# EAGLE design lief-p0r2 (EAGLE 7.5.0)
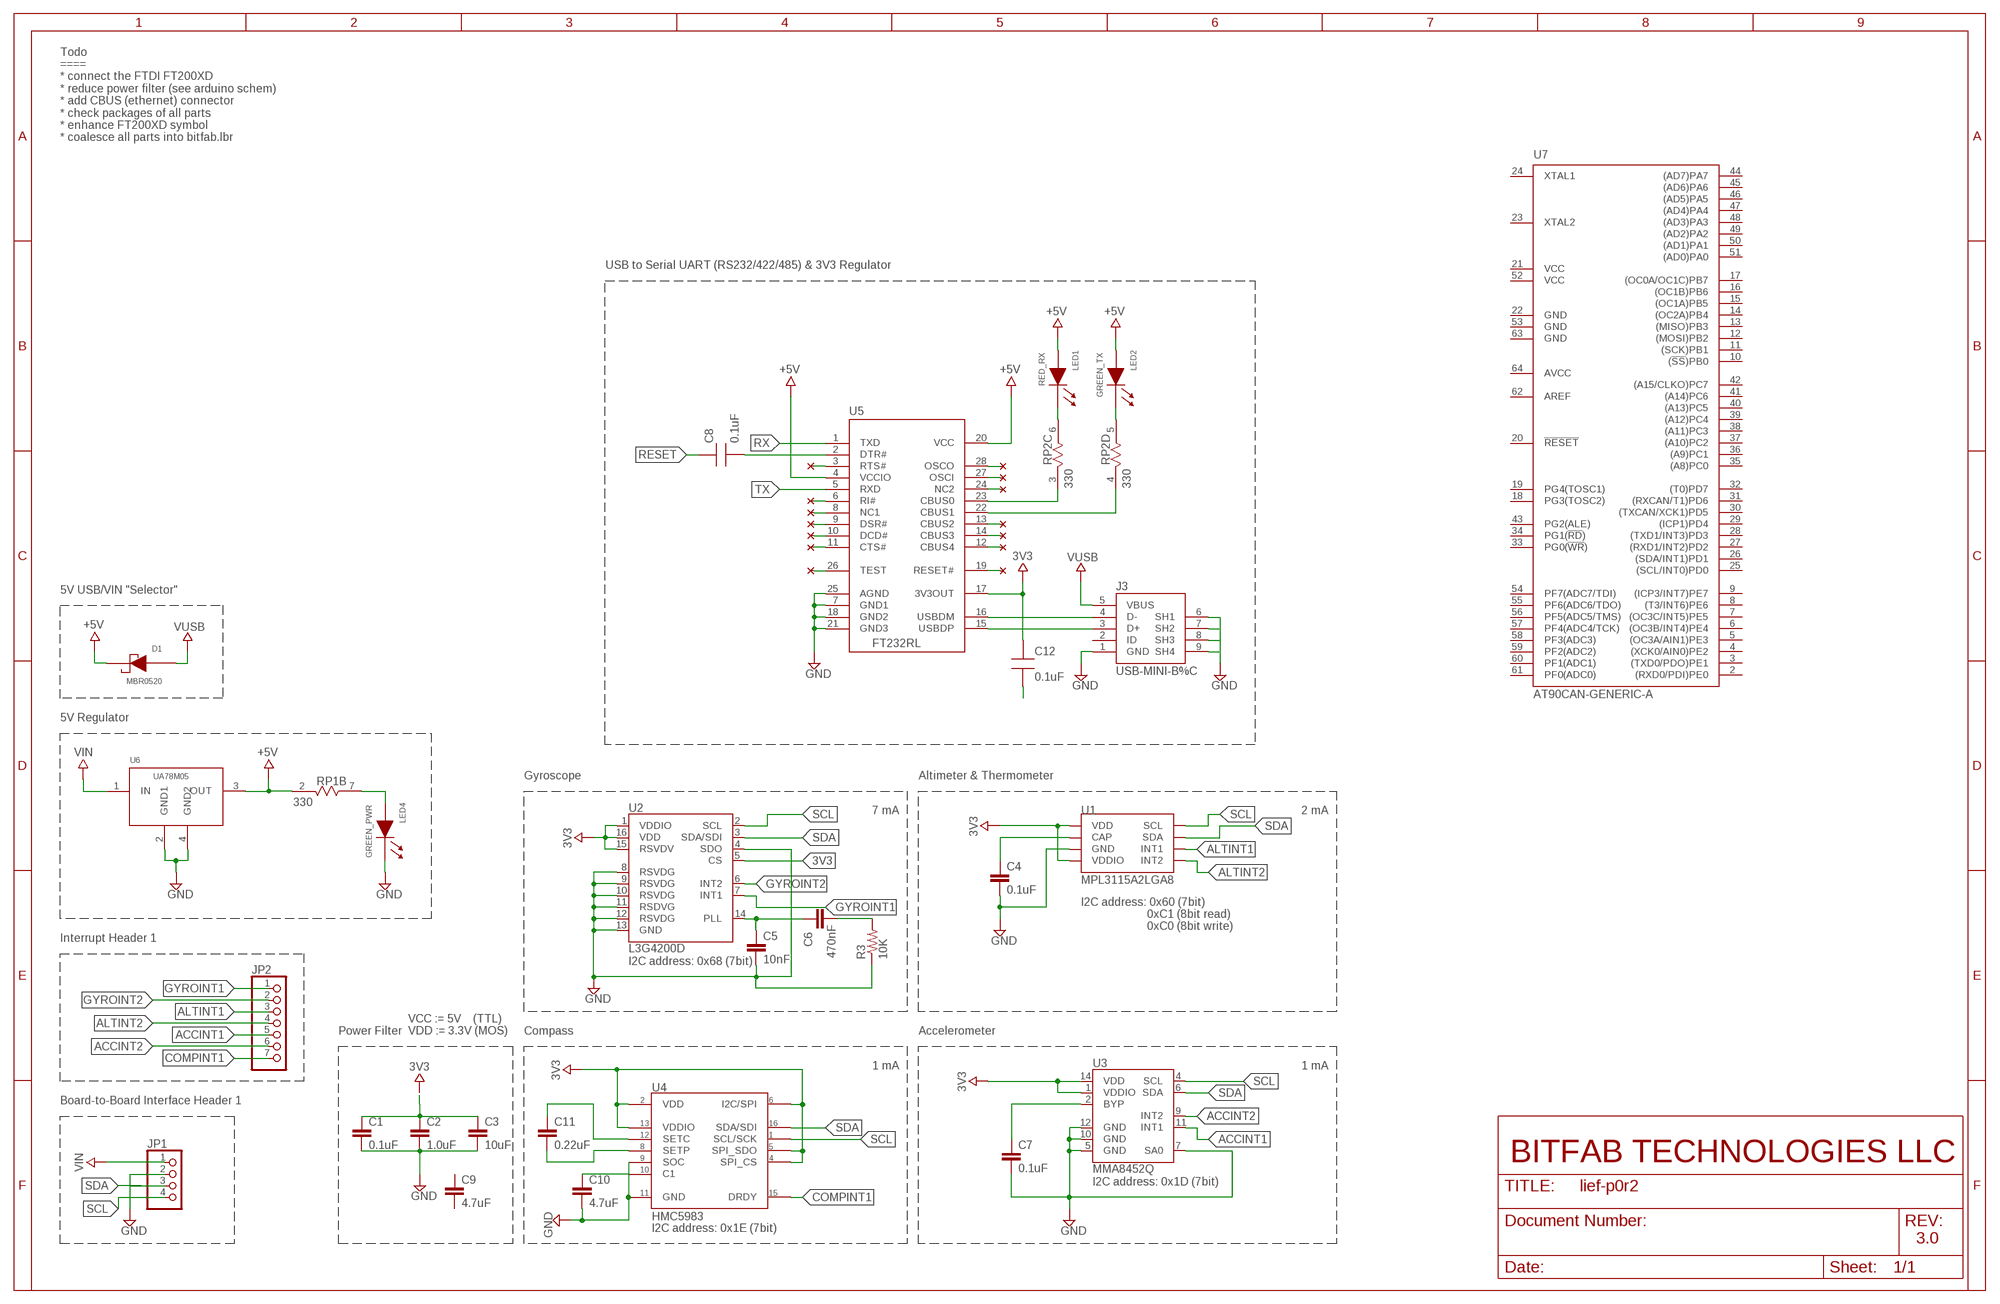
[diagram p0: schematic, sheet 1]

## Parts
C1  0.1uF  0.1UF-25V(+80/-20%)(0603)  [0603-CAP]
C2  1.0uF  1.0UF-25V-+80/-20(0805)"  [0805-CAP]
C3  10uF  1.0UF-25V-+80/-20(0805)"  [0805-CAP]
C4  0.1uF  1.0UF-25V-+80/-20(0805)"  [0805-CAP]
C5  10nF  1.0UF-25V-+80/-20(0805)"  [0805-CAP]
C6  470nF  1.0UF-25V-+80/-20(0805)"  [0805-CAP]
C7  0.1uF  0.1UF-100V-10%(0603)  [0603-CAP]
C8  0.1uF  CAP0805-NP  [CAP0805-NP]
C9  4.7uF  0.1UF-100V-10%(0603)  [0603-CAP]
C10  4.7uF  1.0UF-25V-+80/-20(0805)"  [0805-CAP]
C11  0.22uF  1.0UF-25V-+80/-20(0805)"  [0805-CAP]
C12  0.1uF  CAP0805-NP  [CAP0805-NP]
D1  MBR0520  [SOD-123]
J3  USB-MINI-B%C  [USB-MINI-B_2]
JP1  PINHD-1X4  [1X04]
JP2  PINHD-1X7  [1X07]
LED1  RED_RX  LED0805  [LED0805]
LED2  GREEN_TX  LED0805  [LED0805]
LED4  GREEN_PWR  LED0805  [LED0805]
R3  10K  R-US_0204/2V  [0204V]
RP1  330  RES4NT  [RES4NT]
RP2  330  RES4NT  [RES4NT]
U1  MPL3115A2LGA8  [LGA8]
U2  L3G4200D  [LGA16-4X4]
U3  MMA8452Q  [QFN-16_0.5MM]
U4  HMC5983  [HMC5983-LPCC16]
U5  FT232RL  [SSOP28]
U6  UA78M05  [SOT223]
U7  AT90CAN-GENERIC-A  [TQFP64]

## Nets
3V3: C1.1 C2.1 C3.1 C12.1 U1.1(VDD) U1.4(VDDIO) U2.1(VDDIO) U2.5(CS) U2.15(RSVDV) U2.16(VDD) U3.1(VDDIO) U3.14(VDD) U4.I2C/SPI U4.SPI_CS/S1(SPI_CS) U4.SPI_SDO U4.VDD U4.VDDIO U5.17(3V3OUT)
+5V: D1.1(CA) LED1.2(AN) LED2.2(AN) RP1.2 U5.4(VCCIO) U5.20(VCC) U6.3(OUT)
ACCINT1: JP2.5 U3.11(INT1)
ACCINT2: JP2.6 U3.9(INT2)
ALTINT1: JP2.3 U1.6(INT1)
ALTINT2: JP2.4 U1.5(INT2)
COM: C12.2
COMPINT1: JP2.7 U4.DRDY
GND: C1.2 C2.2 C3.2 C4.2 C5.2 C7.2 C10.2 J3.1(GND) J3.6(SH1) J3.7(SH2) J3.8(SH3) J3.9(SH4) JP1.2 JP1.3 LED4.1(CA) R3.1 U1.3(GND) U2.4(SDO) U2.8(RSVDG) U2.9(RSVDG) U2.10(RSVDG) U2.11(RSDVG) U2.12(RSVDG) U2.13(GND) U3.5(GND) U3.7(SA0) U3.10(GND) U3.12(GND) U4.GND U4.SOC U5.7(GND1) U5.18(GND2) U5.21(GND3) U5.25(AGND) U6.2(GND1) U6.4(GND2)
GYROINT1: JP2.1 U2.7(INT1)
GYROINT2: JP2.2 U2.6(INT2)
N$1: LED4.2(AN) RP1.7
N$2: J3.3(D+) U5.15(USBDP)
N$3: J3.4(D-) U5.16(USBDM)
N$4: C8.2 U5.2(DTR#)
N$5: C11.1 U4.SETC
N$6: C4.1 U1.2(CAP)
N$7: C6.2 R3.2
N$8: C5.1 C6.1 U2.14(PLL)
N$9: C7.1 U3.2(BYP)
N$10: C11.2 U4.SETP
N$11: RP2.3 U5.23(CBUS0)
N$12: C10.1 U4.C1
N$13: RP2.4 U5.22(CBUS1)
N$14: U5.11(CTS#)
N$15: U5.6(RI#)
N$16: U5.8(NC1)
N$17: U5.9(DSR#)
N$18: U5.10(DCD#)
N$19: U5.28(OSCO)
N$20: U5.27(OSCI)
N$21: U5.24(NC2)
N$22: U5.13(CBUS2)
N$23: U5.14(CBUS3)
N$24: U5.12(CBUS4)
N$25: U5.19(RESET#)
N$26: U5.26(TEST)
N$27: U5.3(RTS#)
N$28: LED1.1(CA) RP2.6
N$29: LED2.1(CA) RP2.5
RESET: C8.1
RX: U5.1(TXD)
SCL: JP1.4 U1.8(SCL) U2.2(SCL) U3.4(SCL) U4.SCL/SPI_SCK(SCL/SCK)
SDA: U1.7(SDA) U2.3(SDA/SDI) U3.6(SDA) U4.SDA/SPI_SDI(SDA/SDI)
TX: U5.5(RXD)
VIN: JP1.1 U6.1(IN)
VUSB: D1.2(AN) J3.5(VBUS)
Unconnected: C9.1 C9.2 J3.2(ID) RP1.1 RP1.3 RP1.4 RP1.5 RP1.6 RP1.8 RP2.1 RP2.2 RP2.7 RP2.8 U7.2((RXD0/PDI)PE0) U7.3((TXD0/PDO)PE1) U7.4((XCK0/AIN0)PE2) U7.5((OC3A/AIN1)PE3) U7.6((OC3B/INT4)PE4) U7.7((OC3C/INT5)PE5) U7.8((T3/INT6)PE6) U7.9((ICP3/INT7)PE7) U7.10((!SS!)PB0) U7.11((SCK)PB1) U7.12((MOSI)PB2) U7.13((MISO)PB3) U7.14((OC2A)PB4) U7.15((OC1A)PB5) U7.16((OC1B)PB6) U7.17((OC0A/OC1C)PB7) U7.18(PG3(TOSC2)) U7.19(PG4(TOSC1)) U7.20(!RESET) U7.23(XTAL2) U7.24(XTAL1) U7.25((SCL/INT0)PD0) U7.26((SDA/INT1)PD1) U7.27((RXD1/INT2)PD2) U7.28((TXD1/INT3)PD3) U7.29((ICP1)PD4) U7.30((TXCAN/XCK1)PD5) U7.31((RXCAN/T1)PD6) U7.32((T0)PD7) U7.33(PG0(!WR!)) U7.34(PG1(!RD!)) U7.35((A8)PC0) U7.36((A9)PC1) U7.37((A10)PC2) U7.38((A11)PC3) U7.39((A12)PC4) U7.40((A13)PC5) U7.41((A14)PC6) U7.42((A15/CLKO)PC7) U7.43(PG2(ALE)) U7.44((AD7)PA7) U7.45((AD6)PA6) U7.46((AD5)PA5) U7.47((AD4)PA4) U7.48((AD3)PA3) U7.49((AD2)PA2) U7.50((AD1)PA1) U7.51((AD0)PA0) U7.54(PF7(ADC7/TDI)) U7.55(PF6(ADC6/TDO)) U7.56(PF5(ADC5/TMS)) U7.57(PF4(ADC4/TCK)) U7.58(PF3(ADC3)) U7.59(PF2(ADC2)) U7.60(PF1(ADC1)) U7.61(PF0(ADC0)) U7.62(AREF)

## Notes on the sheet
- Todo
  ====
  * connect the FTDI FT200XD
  * reduce power filter (see arduino schem)
  * add CBUS (ethernet) connector
  * check packages of all parts
  * enhance FT200XD symbol
  * coalesce all parts into bitfab.lbr
- USB to Serial UART (RS232/422/485) & 3V3 Regulator
- 5V USB/VIN "Selector"
- 5V Regulator
- Gyroscope | Altimeter & Thermometer
- 7 mA | 2 mA
- I2C address: 0x60 (7bit)
                        0xC1 (8bit read)
                        0xC0 (8bit write)
- Interrupt Header 1
- I2C address: 0x68 (7bit)
- Power Filter
- VCC := 5V    (TTL)
  VDD := 3.3V (MOS)
- Compass | Accelerometer
- 1 mA | 1 mA
- Board-to-Board Interface Header 1
- BITFAB TECHNOLOGIES LLC
- I2C address: 0x1D (7bit)
- I2C address: 0x1E (7bit)
- 3.0

## Power pins joined to a net without a drawn wire
AVCC: U7.64(AVCC)
GND: U7.22(GND) U7.53(GND) U7.63(GND)
VCC: U7.21(VCC) U7.52(VCC)

## Library data of the parts
C1 = SparkFun-Capacitors:0.1UF-25V(+80/-20%)(0603): CAP-00810 Ceramic Standard decoupling cap; PROD_ID: CAP-00810
C2 = SparkFun-Capacitors:1.0UF-25V-+80/-20(0805): CAP-11625; PROD_ID: CAP-11625
C3-C6 C10 C11 = SparkFun-Capacitors:1.0UF-25V-+80/-20(0805): CAP-11625; PROD_ID: CAP-11625; VALUE: 1.0uF
C7 = SparkFun-Capacitors:0.1UF-100V-10%(0603): CAP-08390; PROD_ID: CAP-08390
C8 C12 = MySMD:CAP0805-NP
C9 = SparkFun-Capacitors:0.1UF-100V-10%(0603): CAP-08390; PROD_ID: CAP-08390; VALUE: 0.1uF
D1 = MySMD:MBR0520
J3 = MyCON2:USB-MINI-B
JP1 = pinhead:PINHD-1X4: PIN HEADER
JP2 = pinhead:PINHD-1X7: PIN HEADER
LED1 LED2 LED4 = MySMD:LED0805
R3 = resistor:R-US_: RESISTOR, American symbol
RP1 RP2 = MySMD:RES4NT
U1 = SparkFun-Sensors:MPL3115A2: Altimeter/Pressure Sensor, I2C, 1.95V-3.6V supply, 50 to 110kPa; PROD_ID: IC-10869
U2 = SparkFun-Sensors:L3G4200D: L3G4200D Three-axis, digital output gyroscope The L3G4200D is a low-power three-axis angular rate sensor, has a full scale of ±250/±500/±2000 dps and is capable of measuring rates with a user-selectable bandwidth. It includes a sensing element and an IC interface capable of providing the measured angular rate to the external world through a digital interface (I2C/SPI). Package: 4x4x1.1 LGA-16 (LGA16-4x4.PAC)
U3 = SparkFun-Sensors:MMA8452Q: MMA8452Q 3-Axis, 12/8-bit Digital Accelerometer Supply Voltage: 1.6-3.6V Range: +/- 2g, 4g, 8g Interface: I2C, 12-bit and 8-bit ODR: 1.56 Hz - 800 Hz Package: QFN-16 http://cache.freescale.com/files/sensors/doc/data_sheet/MMA8452Q.pdf; PROD_ID: IC-10769
U4 = bitfab:HMC5983: HMC5983 - 3-Axis Digital Compass IC VDD MIN: 2.16V, TYP: 2.5V, MAX: 3.6V, ABSMAX: 4.8V 3.0x3.0x0.9mm LCC Surface Mount Package
U5 = MySMD2:FT232RL
U6 = MySMD:UA78M05
U7 = at90can32_64_128:AT90CAN*: ATMEL AVR AT90CAN32-..A. / 64-..A. / 128-..A., TQFP64 (Atmel Package Code 'A2 64': 64-Lead, Thin 1.0 mm / 0.03937 in. Plastic Gull Wing Quad Flat Package) Ordering Code = Product Marking / Speed (MHz) / Power Supply (V) / Operation Range AT90CANx-16AI / 16 / 2.7 .. 5.5 / Industrial (-40 .. +85)°C AT90CANx-16AU / 16 / 2.7 .. 5.5 / Industrial Green (-40 .. +85)°C x = 32 / 64 / 128 (KB of ISP Flash Memory) Author: Dipl.-Ing. FH Rainer Bayer HHN Hochschule Heilbronn, rainer.bayer@hs-heilbronn.de Ingenieurbüro ing-rb, mail@ing-rb.de

## Board
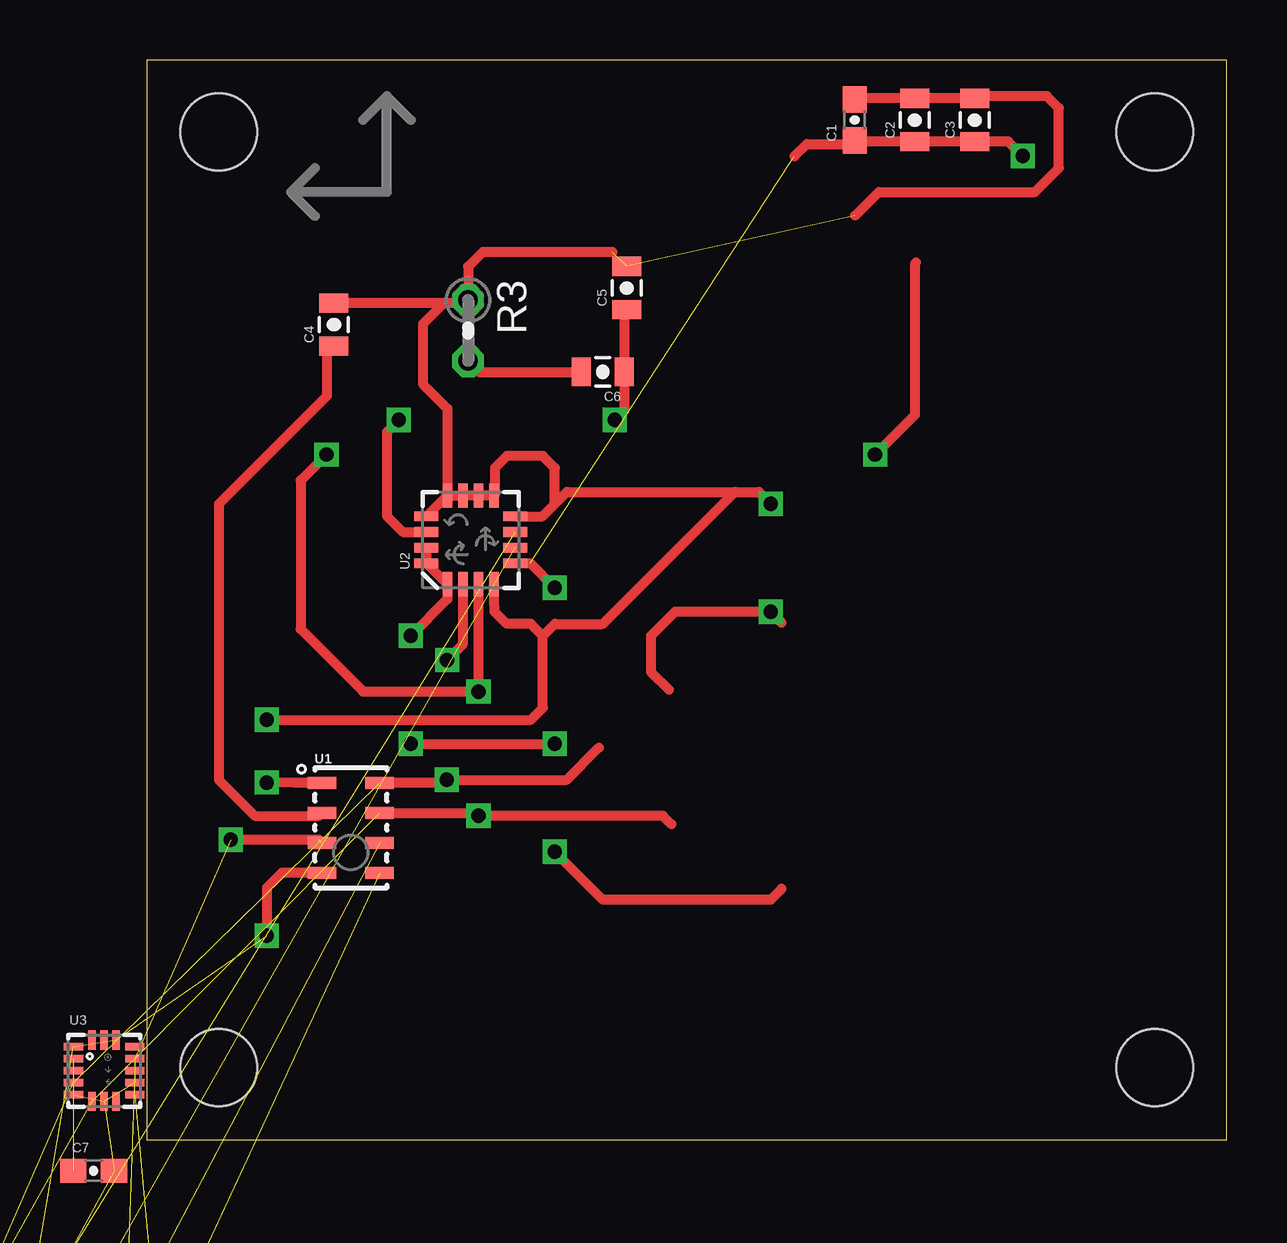
[diagram p1: board, top side]
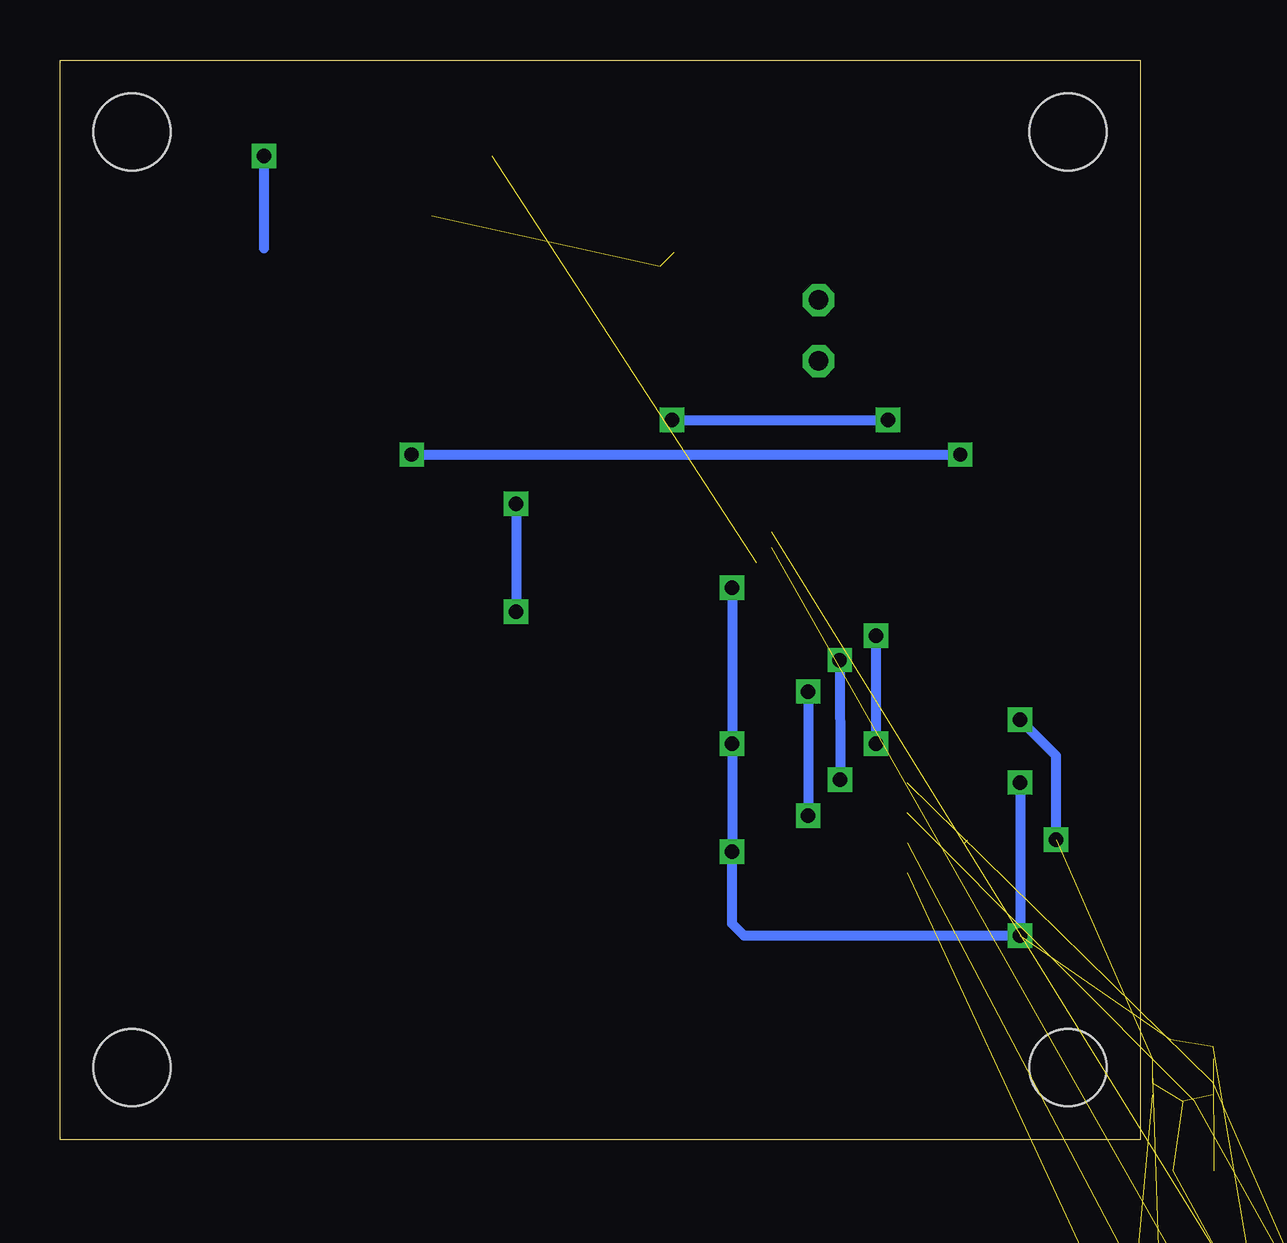
[diagram p2: board, bottom side, seen from below]

Size 45 x 45 mm. Coordinates in mm from the lower left corner, seen from the top.
Outline: 0,0 45,0 45,45 0,45 0,0
Copper layers (1*16): Top 0.035mm / dielectric 1.5mm / Bottom 0.035mm
Design rules "default *": minimum track width 10mil, minimum drill 7mil, track to track 8mil, track to pad 8mil, pad to pad 8mil, via to via 8mil, smd to smd 8mil, copper to edge 40mil, drill to drill 8mil, minimum pad ring 10mil, minimum via ring 8mil, stop-mask expansion 4mil, vias tented up to drill 0mil, thermal gap 10mil
Holes 3.2 mm at 3,3 42,3 42,42 3,42

### Footprints (pad centres in the part's own frame; a part is rotated, then mirrored left to right if it is on the bottom)
0603-CAP = smd 1.1 x 1: 1 -0.85,0; 2 0.85,0
0805-CAP = smd 0.8 x 1.2: 1 -0.9,0; 2 0.9,0
CAP0805-NP = smd 1.524 x 1.524: 1 0,0; 2 2.286,0
SOD-123 = smd 1.143 x 1.143: 1 0,0; 2 3.429,0
USB-MINI-B_2 = smd 0.508 x 2.54: 1 0,0; 2 0.8,0; 3 1.6,0; 4 2.4,0; 5 3.2,0 | smd 2.286 x 1.778: 6 -2.717,5.948; 7 -2.717,0.36; 8 5.918,0.36; 9 5.918,5.948 | hole 0.813: -0.6,2.9; 3.8,2.9
1X04 = drill 1.016 long: 1 -3.81,0; 2 -1.27,0; 3 1.27,0; 4 3.81,0
1X07 = drill 1.016 long: 1 -7.62,0; 2 -5.08,0; 3 -2.54,0; 4 0,0; 5 2.54,0; 6 5.08,0; 7 7.62,0
LED0805 = smd 1.524 x 1.524: 1 0,0; 2 2.286,0
0204V = drill 0.813 octagon: 1 -1.27,0; 2 1.27,0
RES4NT = smd 0.508 x 1.016: 1 0,0; 2 0.8,0; 3 1.6,0; 4 2.4,0; 5 2.4,1.651; 6 1.6,1.651; 7 0.8,1.651; 8 0,1.651
LGA8 = smd 1.2 x 0.5: 1 -1.2,1.875; 2 -1.2,0.625; 3 -1.2,-0.625; 4 -1.2,-1.875; 5 1.2,-1.875; 6 1.2,-0.625; 7 1.2,0.625; 8 1.2,1.875
LGA16-4X4 = smd 1 x 0.4: 1 -1.85,0.975; 2 -1.85,0.325; 3 -1.85,-0.325; 4 -1.85,-0.975; 9 1.85,-0.975; 10 1.85,-0.325; 11 1.85,0.325; 12 1.85,0.975 | smd 0.4 x 1: 5 -0.975,-1.85; 6 -0.325,-1.85; 7 0.325,-1.85; 8 0.975,-1.85; 13 0.975,1.85; 14 0.325,1.85; 15 -0.325,1.85; 16 -0.975,1.85
QFN-16_0.5MM = smd 0.8 x 0.3: 1 -1.275,1; 2 -1.275,0.5; 3 -1.275,0; 4 -1.275,-0.5; 5 -1.275,-1; 9 1.275,-1; 10 1.275,-0.5; 11 1.275,0; 12 1.275,0.5; 13 1.275,1 | smd 0.3 x 0.8: 6 -0.5,-1.275; 7 0,-1.275; 8 0.5,-1.275; 14 0.5,1.275; 15 0,1.275; 16 -0.5,1.275
HMC5983-LPCC16 = smd 0.45 x 0.3: C1 1.275,-0.25; GND 1.275,0.25; NC1 -1.275,-0.25; SCL/SPI_SCK -1.275,0.75; SETC 1.275,0.75; SOC 1.275,-0.75; SPI_CS/S1 -1.275,-0.75; VDD -1.275,0.25 | smd 0.3 x 0.45: DRDY -0.25,1.275; I2C/SPI -0.25,-1.275; NC2 0.25,-1.275; NC3 0.25,1.275; SDA/SPI_SDI -0.75,1.275; SETP 0.75,-1.275; SPI_SDO -0.75,-1.275; VDDIO 0.75,1.275
SSOP28 = smd 0.381 x 2.032: 1 0,0; 2 0.65,0; 3 1.3,0; 4 1.95,0; 5 2.6,0; 6 3.25,0; 7 3.9,0; 8 4.55,0; 9 5.2,0; 10 5.85,0; 11 6.5,0; 12 7.15,0; 13 7.8,0; 14 8.45,0; 15 8.45,7.112; 16 7.8,7.112; 17 7.15,7.112; 18 6.5,7.112; 19 5.85,7.112; 20 5.2,7.112; 21 4.55,7.112; 22 3.9,7.112; 23 3.25,7.112; 24 2.6,7.112; 25 1.95,7.112; 26 1.3,7.112; 27 0.65,7.112; 28 0,7.112
SOT223 = smd 1.524 x 2.032: 1 0,0; 2 2.286,0; 3 4.572,0 | smd 3.81 x 2.032: 4 2.286,6.604
TQFP64 = smd 1.194 x 0.559: 1 -7.76,5.905; 2 -7.76,5.118; 3 -7.76,4.331; 4 -7.76,3.543; 5 -7.76,2.756; 6 -7.76,1.968; 7 -7.76,1.181; 8 -7.76,0.394; 9 -7.76,-0.394; 10 -7.76,-1.181; 11 -7.76,-1.968; 12 -7.76,-2.756; 13 -7.76,-3.543; 14 -7.76,-4.331; 15 -7.76,-5.118; 16 -7.76,-5.905; 33 7.76,-5.905; 34 7.76,-5.118; 35 7.76,-4.331; 36 7.76,-3.543; 37 7.76,-2.756; 38 7.76,-1.968; 39 7.76,-1.181; 40 7.76,-0.394; 41 7.76,0.394; 42 7.76,1.181; 43 7.76,1.968; 44 7.76,2.756; 45 7.76,3.543; 46 7.76,4.331; 47 7.76,5.118; 48 7.76,5.905 | smd 0.559 x 1.194: 17 -5.905,-7.76; 18 -5.118,-7.76; 19 -4.331,-7.76; 20 -3.543,-7.76; 21 -2.756,-7.76; 22 -1.968,-7.76; 23 -1.181,-7.76; 24 -0.394,-7.76; 25 0.394,-7.76; 26 1.181,-7.76; 27 1.968,-7.76; 28 2.756,-7.76; 29 3.543,-7.76; 30 4.331,-7.76; 31 5.118,-7.76; 32 5.905,-7.76; 49 5.905,7.76; 50 5.118,7.76; 51 4.331,7.76; 52 3.543,7.76; 53 2.756,7.76; 54 1.968,7.76; 55 1.181,7.76; 56 0.394,7.76; 57 -0.394,7.76; 58 -1.181,7.76; 59 -1.968,7.76; 60 -2.756,7.76; 61 -3.543,7.76; 62 -4.331,7.76; 63 -5.118,7.76; 64 -5.905,7.76

### Placement (x,y rotation side)
C1  29.5,42.5 90 top
C2  32,42.5 90 top
C3  34.5,42.5 90 top
C4  7.79,33.97 90 top
C5  20,35.5 90 top
C6  19,32 180 top
C7  -2.21,-1.3 0 top
C8  -8.37,-52.64 0 top  (outside the outline)
C9  -2.21,-7.21 0 top  (outside the outline)
C10  -8.78,-6.96 0 top  (outside the outline)
C11  -11.72,-6.96 0 top  (outside the outline)
C12  -4.2,-52.64 0 top  (outside the outline)
D1  -8.76,-65.6 0 top  (outside the outline)
J3  -7.92,-35.52 0 top  (outside the outline)
JP1  -7.58,-12.39 0 top  (outside the outline)
JP2  -3.77,-17.97 0 top  (outside the outline)
LED1  -12.54,-52.64 0 top  (outside the outline)
LED2  2.14,-41.03 0 top  (outside the outline)
LED4  -12.54,-70.48 0 top  (outside the outline)
R3  13.39,33.72 270 top
RP1  -12.79,-66.87 0 top  (outside the outline)
RP2  -2.28,-42.42 0 top  (outside the outline)
U1  8.5,13 0 top
U2  13.5,25 90 top
U3  -1.78,2.88 0 top
U4  -5.34,-6.5 0 top  (outside the outline)
U5  -12.67,-48.4 0 top  (outside the outline)
U6  -11.9,-62.52 0 top  (outside the outline)
U7  -5,-81.58 0 top  (outside the outline)

### Tracks (layer width: path | path; a pad name or v marks a point on that pad's centre or on a via)
3V3  (via drill 0.6)  (10 unrouted)
  Top 0.406: 32.08,41.63 C2.1 | C2.1 C3.1 35.9,41.6 v36.5,41 | C2.1 29.55,41.6 C1.1 29.35,41.5 27.5,41.5 26.98,40.98 | U2.5 15.97,24.02 v17,23 | 26.45,10.45 26,10 19,10 v17,12 | U1.4 5.62,11.12 5,10.5 v5,8.5 | U1.1 6.12,14.88 v5,14.88 | U2.15 U2.16 U2.1 12.53,22.52 v11,21 | v11,16.5 v17,16.5
  Bottom 0.406: v17,23 v17,16.5 v17,12 17,9 16.5,8.5 v5,8.5 v5,14.88 | 36.5,37.14 v36.5,41 | v11,16.5 v11,21
+5V  (6 unrouted)
ACCINT1  (1 unrouted)
ACCINT2  (1 unrouted)
ALTINT1  (1 unrouted)
ALTINT2  (1 unrouted)
COMPINT1  (1 unrouted)
GND  (via drill 0.6)  (28 unrouted)
  Top 0.406: 32.08,43.44 C2.2 | 29.52,38.52 30.5,39.5 37,39.5 38,40.5 38,43 37.5,43.5 34.6,43.5 C3.2 C2.2 | C2.2 29.55,43.4 C1.2 | 19.4,37 14,37 13.39,36.39 R3.1 13.27,34.87 12.37,34.87 | 12.37,34.87 C4.2 | 12.37,34.87 11.5,34 11.5,31.5 12.53,30.48 U2.12 | U2.8 16.48,25.98 17,26.5 | 17,26.5 17,28 16.5,28.5 15,28.5 14.5,28 14.5,26.88 U2.9 U2.10 U2.11 U2.12 | U2.12 U2.13 | 26.45,21.55 v26,22 22,22 21,21 21,19.5 21.76,18.74 | 17,26.5 17.5,27 24.5,27 | 24.5,27 25.5,27 v26,26.5 | 7.17,12.5 v3.5,12.5 | v5,17.5 16,17.5 16.5,18 16.5,21 | 16.5,21 16,21.5 15,21.5 14.49,22 14.46,23.12 U2.4 | 16.5,21 17,21.5 19,21.5 24.5,27
  Bottom 0.406: v26,26.5 v26,22 | v3.5,12.5 3.5,16 v5,17.5
GYROINT1  (1 unrouted)
GYROINT2  (1 unrouted)
N$1  (1 unrouted)
N$2  (1 unrouted)
N$3  (1 unrouted)
N$4  (1 unrouted)
N$5  (1 unrouted)
N$6
  Top 0.406: C4.1 7.5,32.77 7.5,31 3,26.5 3,15 4.5,13.5 7.17,13.5 U1.2
N$7
  Top 0.406: R3.2 13.84,32 C6.2
N$8  (via drill 0.6)
  Top 0.406: C5.1 19.9,34.5 C6.1 19.9,30.4 v19.5,30 | v10.5,30 10,29.5 10,26 10.68,25.32 U2.14
  Bottom 0.406: v19.5,30 v10.5,30
N$9  (1 unrouted)
N$10  (1 unrouted)
N$11  (1 unrouted)
N$12  (1 unrouted)
N$13  (1 unrouted)
N$28  (1 unrouted)
N$29  (1 unrouted)
SCL  (via drill 0.6)  (3 unrouted)
  Top 0.406: U2.2 13.16,20.63 v12.52,19.98 | U1.8 12.38,14.88 v12.5,15 17.5,15 18.84,16.34
  Bottom 0.406: v12.52,19.98 v12.5,15
SDA  (via drill 0.6)  (2 unrouted)
  Top 0.406: 32.06,36.56 32,36.5 32,32.05 | U1.7 13.7,13.62 arc-90 v13.82,13.5 21.5,13.5 21.86,13.14 | 32,32.05 32.02,32.03 | 32,32.05 32,30.2 v30.35,28.55 | v7.49,28.55 6.42,27.48 6.42,21.28 9.02,18.68 v13.82,18.68 U2.3
  Bottom 0.406: v13.82,18.68 v13.82,13.5 | v30.35,28.55 v7.49,28.55
VCC  (1 unrouted)
VIN  (1 unrouted)
VUSB  (1 unrouted)

### Text on the board
tDocu: x | y